# Altium schematic sheet InputOutput.SchDoc
size A4
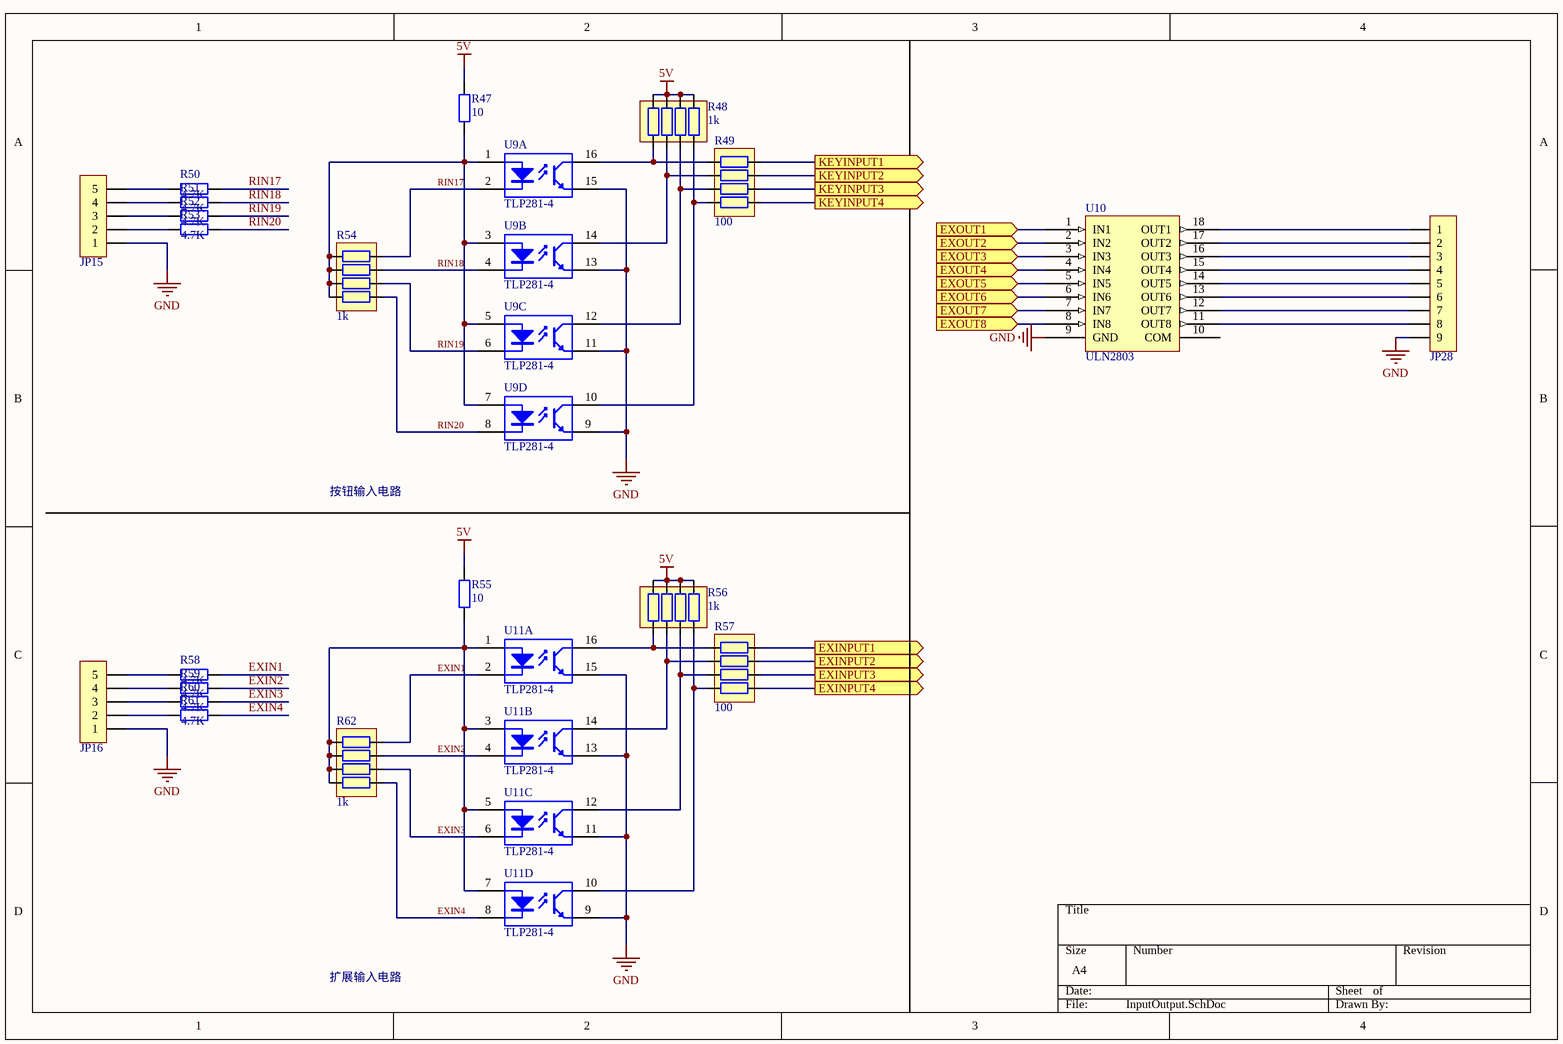
[diagram p0: InputOutput.SchDoc]

## Parts
JP15  HDR-1X5  [XH2.54-LI-5P]  (value not drawn)
JP16  HDR-1X5  [XH2.54-LI-5P]  (value not drawn)
JP28  HDR-1X9  [XH2.54-LI-9P]  (value not drawn)
R47  10  [R 0603_L]
R48  1k  [RCA-8P4R-0603]
R49  100  [RCA-8P4R-0603]
R50  4.7K  [R 0603_L]
R51  4.7K  [R 0603_L]
R52  4.7K  [R 0603_L]
R53  4.7K  [R 0603_L]
R54  1k  [RCA-8P4R-0603]
R55  10  [R 0603_L]
R56  1k  [RCA-8P4R-0603]
R57  100  [RCA-8P4R-0603]
R58  4.7K  [R 0603_L]
R59  4.7K  [R 0603_L]
R60  4.7K  [R 0603_L]
R61  4.7K  [R 0603_L]
R62  1k  [RCA-8P4R-0603]
U9  TLP281-4  [SOP16N_N]  (parts A,B,C,D of 4)
U10  ULN2803  [SO-G18]
U11  TLP281-4  [SOP16N_N]  (parts A,B,C,D of 4)

## Ports
EXINPUT1 (out), EXINPUT2 (out), EXINPUT3 (out), EXINPUT4 (out), EXOUT1 (in), EXOUT2 (in), EXOUT3 (in), EXOUT4 (in), EXOUT5 (in), EXOUT6 (in), EXOUT7 (in), EXOUT8 (in), KEYINPUT1 (out), KEYINPUT2 (out), KEYINPUT3 (out), KEYINPUT4 (out)

## Nets
5V: R47.1 R48.5 R48.6 R48.7 R48.8 R55.1 R56.5 R56.6 R56.7 R56.8
GND: JP15.1 JP16.1 JP28.9 U9.9 U9.11 U9.13 U9.15 U10.9(GND) U11.9 U11.11 U11.13 U11.15
EXIN1: R58.1 R62.8 U11.2
EXIN2: R59.1 R62.7 U11.4
EXIN3: R60.1 R62.6 U11.6
EXIN4: R61.1 R62.5 U11.8
EXINPUT1: R57.1 ; port EXINPUT1
EXINPUT2: R57.2 ; port EXINPUT2
EXINPUT3: R57.3 ; port EXINPUT3
EXINPUT4: R57.4 ; port EXINPUT4
EXOUT1: U10.1(IN1) ; port EXOUT1
EXOUT2: U10.2(IN2) ; port EXOUT2
EXOUT3: U10.3(IN3) ; port EXOUT3
EXOUT4: U10.4(IN4) ; port EXOUT4
EXOUT5: U10.5(IN5) ; port EXOUT5
EXOUT6: U10.6(IN6) ; port EXOUT6
EXOUT7: U10.7(IN7) ; port EXOUT7
EXOUT8: U10.8(IN8) ; port EXOUT8
KEYINPUT1: R49.1 ; port KEYINPUT1
KEYINPUT2: R49.2 ; port KEYINPUT2
KEYINPUT3: R49.3 ; port KEYINPUT3
KEYINPUT4: R49.4 ; port KEYINPUT4
RIN17: R50.1 R54.8 U9.2
RIN18: R51.1 R54.7 U9.4
RIN19: R52.1 R54.6 U9.6
RIN20: R53.1 R54.5 U9.8
NetJP15_2: JP15.2 R53.2
NetJP15_3: JP15.3 R52.2
NetJP15_4: JP15.4 R51.2
NetJP15_5: JP15.5 R50.2
NetJP16_2: JP16.2 R61.2
NetJP16_3: JP16.3 R60.2
NetJP16_4: JP16.4 R59.2
NetJP16_5: JP16.5 R58.2
NetJP28_1: JP28.1 U10.18(OUT1)
NetJP28_2: JP28.2 U10.17(OUT2)
NetJP28_3: JP28.3 U10.16(OUT3)
NetJP28_4: JP28.4 U10.15(OUT4)
NetJP28_5: JP28.5 U10.14(OUT5)
NetJP28_6: JP28.6 U10.13(OUT6)
NetJP28_7: JP28.7 U10.12(OUT7)
NetJP28_8: JP28.8 U10.11(OUT8)
NetR47_2: R47.2 R54.1 R54.2 R54.3 R54.4 U9.1 U9.3 U9.5 U9.7
NetR48_1: R48.1 R49.8 U9.16
NetR48_2: R48.2 R49.7 U9.14
NetR48_3: R48.3 R49.6 U9.12
NetR48_4: R48.4 R49.5 U9.10
NetR55_2: R55.2 R62.1 R62.2 R62.3 R62.4 U11.1 U11.3 U11.5 U11.7
NetR56_1: R56.1 R57.8 U11.16
NetR56_2: R56.2 R57.7 U11.14
NetR56_3: R56.3 R57.6 U11.12
NetR56_4: R56.4 R57.5 U11.10

Not connected (* = marked no-connect by the designer): U10 10(COM)

## Notes on the sheet
- 按钮输入电路
- 扩展输入电路

## Library data of the parts
JP15 JP16 = Header 5: 5P接插件; 版权归属: 源创客; BOM名称: 5P接插件; 学习资源: www.ooocke.com
JP28 = Header 9: 9P接插件; 版权归属: 源创客; BOM名称: 9P接插件; 学习资源: www.ooocke.com
R47 R50-R53 R55 R58-R61 = R: 贴片电阻; 版权归属: 源创客; BOM名称: 贴片电阻; 学习资源: www.ooocke.com
R48 R49 R54 R56 R57 R62 = R-8P4R: 贴片网络排阻; 版权归属: 源创客; BOM名称: 贴片网络排阻; 学习资源: www.ooocke.com